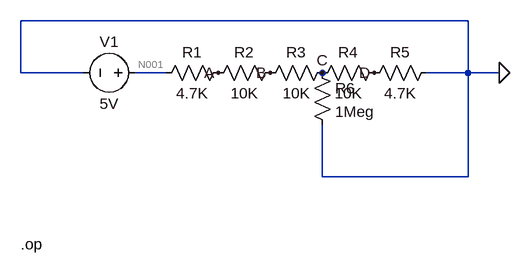
[diagram p0: schematic 3-1_Resistor-Ladder-Example_c.asc]
3-1_Resistor-Ladder-Example_c.asc, the LTspice schematic file:
Version 4.1
SHEET 1 880 680
WIRE 288 -304 -400 -304
WIRE -400 -224 -400 -304
WIRE -304 -224 -400 -224
WIRE -176 -224 -224 -224
WIRE 288 -224 288 -304
WIRE 288 -224 224 -224
WIRE 336 -224 288 -224
WIRE 64 -64 64 -144
WIRE 288 -64 288 -224
WIRE 288 -64 64 -64
FLAG 336 -224 0
FLAG -96 -224 A
FLAG -16 -224 B
FLAG 64 -224 C
FLAG 144 -224 D
SYMBOL res -80 -240 R90
WINDOW 0 0 56 VBottom 2
WINDOW 3 32 56 VTop 2
SYMATTR InstName R1
SYMATTR Value 4.7K
SYMBOL res 0 -240 R90
WINDOW 0 0 56 VBottom 2
WINDOW 3 32 56 VTop 2
SYMATTR InstName R2
SYMATTR Value 10K
SYMBOL res 80 -240 R90
WINDOW 0 0 56 VBottom 2
WINDOW 3 32 56 VTop 2
SYMATTR InstName R3
SYMATTR Value 10K
SYMBOL res 160 -240 R90
WINDOW 0 0 56 VBottom 2
WINDOW 3 32 56 VTop 2
SYMATTR InstName R4
SYMATTR Value 10K
SYMBOL res 240 -240 R90
WINDOW 0 0 56 VBottom 2
WINDOW 3 32 56 VTop 2
SYMATTR InstName R5
SYMATTR Value 4.7K
SYMBOL voltage -208 -224 R90
WINDOW 0 -32 56 VBottom 2
WINDOW 3 32 56 VTop 2
WINDOW 123 0 0 Left 0
WINDOW 39 0 0 Left 0
SYMATTR InstName V1
SYMATTR Value 5V
SYMBOL res 48 -240 R0
SYMATTR InstName R6
SYMATTR Value 1Meg
TEXT -400 40 Left 2 !.op

The netlist it stands for:
* 3-1_Resistor-Ladder-Example_c.asc
R1 A N001 4.7K
R2 B A 10K
R3 C B 10K
R4 D C 10K
R5 0 D 4.7K
V1 N001 0 5V
R6 C 0 1Meg
.op
.backanno
.end

* Results of the author's LTspice run, read from the files saved beside the schematic
* Operating Point:
*   V(a) = 4.4 V
*   V(b) = 3.124 V
*   V(c) = 1.848 V
*   V(d) = 591 mV
*   V(n001) = 5 V
*   I(R1) = -127.6 µA
*   I(R2) = -127.6 µA
*   I(R3) = -127.6 µA
*   I(R4) = -125.7 µA
*   I(R5) = -125.7 µA
*   I(R6) = 1.848 µA
*   I(V1) = -127.6 µA